# EAGLE schematic main (EAGLE 6.5.0)
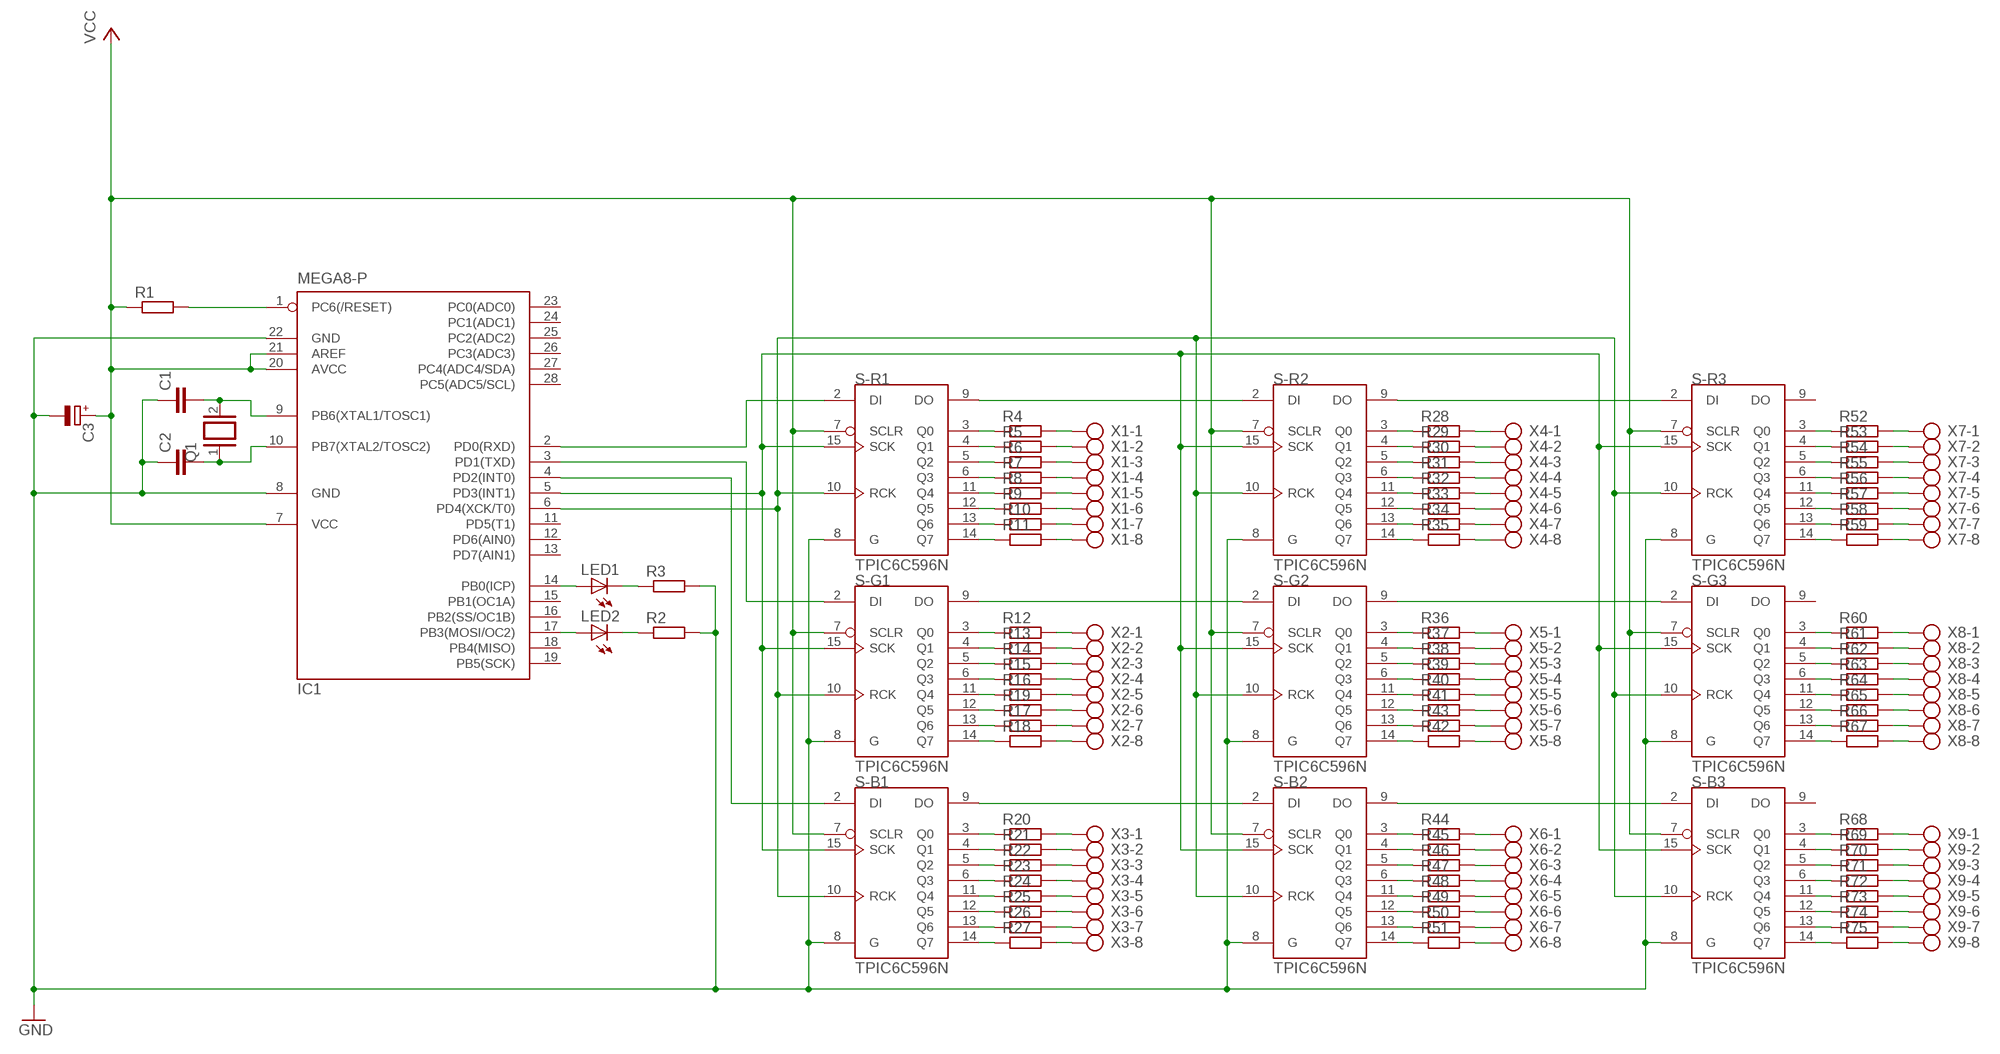
[diagram p0: schematic, sheet 1]

## Parts
C1  C-EU025-025X050  [C025-025X050]
C2  C-EU025-025X050  [C025-025X050]
C3  CPOL-EUE2.5-7  [E2,5-7]
IC1  MEGA8-P  [DIL28-3]
LED1  LED3MM  [LED3MM]
LED2  LED3MM  [LED3MM]
Q1  XTAL/S  [QS]
R1  R-EU_0207/2V  [0207/2V]
R2  R-EU_0207/2V  [0207/2V]
R3  R-EU_0207/2V  [0207/2V]
R4  R-EU_0207/2V  [0207/2V]
R5  R-EU_0207/2V  [0207/2V]
R6  R-EU_0207/2V  [0207/2V]
R7  R-EU_0207/2V  [0207/2V]
R8  R-EU_0207/2V  [0207/2V]
R9  R-EU_0207/2V  [0207/2V]
R10  R-EU_0207/2V  [0207/2V]
R11  R-EU_0207/2V  [0207/2V]
R12  R-EU_0207/2V  [0207/2V]
R13  R-EU_0207/2V  [0207/2V]
R14  R-EU_0207/2V  [0207/2V]
R15  R-EU_0207/2V  [0207/2V]
R16  R-EU_0207/2V  [0207/2V]
R17  R-EU_0207/2V  [0207/2V]
R18  R-EU_0207/2V  [0207/2V]
R19  R-EU_0207/2V  [0207/2V]
R20  R-EU_0207/2V  [0207/2V]
R21  R-EU_0207/2V  [0207/2V]
R22  R-EU_0207/2V  [0207/2V]
R23  R-EU_0207/2V  [0207/2V]
R24  R-EU_0207/2V  [0207/2V]
R25  R-EU_0207/2V  [0207/2V]
R26  R-EU_0207/2V  [0207/2V]
R27  R-EU_0207/2V  [0207/2V]
R28  R-EU_0207/2V  [0207/2V]
R29  R-EU_0207/2V  [0207/2V]
R30  R-EU_0207/2V  [0207/2V]
R31  R-EU_0207/2V  [0207/2V]
R32  R-EU_0207/2V  [0207/2V]
R33  R-EU_0207/2V  [0207/2V]
R34  R-EU_0207/2V  [0207/2V]
R35  R-EU_0207/2V  [0207/2V]
R36  R-EU_0207/2V  [0207/2V]
R37  R-EU_0207/2V  [0207/2V]
R38  R-EU_0207/2V  [0207/2V]
R39  R-EU_0207/2V  [0207/2V]
R40  R-EU_0207/2V  [0207/2V]
R41  R-EU_0207/2V  [0207/2V]
R42  R-EU_0207/2V  [0207/2V]
R43  R-EU_0207/2V  [0207/2V]
R44  R-EU_0207/2V  [0207/2V]
R45  R-EU_0207/2V  [0207/2V]
R46  R-EU_0207/2V  [0207/2V]
R47  R-EU_0207/2V  [0207/2V]
R48  R-EU_0207/2V  [0207/2V]
R49  R-EU_0207/2V  [0207/2V]
R50  R-EU_0207/2V  [0207/2V]
R51  R-EU_0207/2V  [0207/2V]
R52  R-EU_0207/2V  [0207/2V]
R53  R-EU_0207/2V  [0207/2V]
R54  R-EU_0207/2V  [0207/2V]
R55  R-EU_0207/2V  [0207/2V]
R56  R-EU_0207/2V  [0207/2V]
R57  R-EU_0207/2V  [0207/2V]
R58  R-EU_0207/2V  [0207/2V]
R59  R-EU_0207/2V  [0207/2V]
R60  R-EU_0207/2V  [0207/2V]
R61  R-EU_0207/2V  [0207/2V]
R62  R-EU_0207/2V  [0207/2V]
R63  R-EU_0207/2V  [0207/2V]
R64  R-EU_0207/2V  [0207/2V]
R65  R-EU_0207/2V  [0207/2V]
R66  R-EU_0207/2V  [0207/2V]
R67  R-EU_0207/2V  [0207/2V]
R68  R-EU_0207/2V  [0207/2V]
R69  R-EU_0207/2V  [0207/2V]
R70  R-EU_0207/2V  [0207/2V]
R71  R-EU_0207/2V  [0207/2V]
R72  R-EU_0207/2V  [0207/2V]
R73  R-EU_0207/2V  [0207/2V]
R74  R-EU_0207/2V  [0207/2V]
R75  R-EU_0207/2V  [0207/2V]
S-B1  TPIC6C596N  [DIL16]
S-B2  TPIC6C596N  [DIL16]
S-B3  TPIC6C596N  [DIL16]
S-G1  TPIC6C596N  [DIL16]
S-G2  TPIC6C596N  [DIL16]
S-G3  TPIC6C596N  [DIL16]
S-R1  TPIC6C596N  [DIL16]
S-R2  TPIC6C596N  [DIL16]
S-R3  TPIC6C596N  [DIL16]
X1  AK500/8-H  [AK500/8-H]
X2  AK500/8-H  [AK500/8-H]
X3  AK500/8-H  [AK500/8-H]
X4  AK500/8-H  [AK500/8-H]
X5  AK500/8-H  [AK500/8-H]
X6  AK500/8-H  [AK500/8-H]
X7  AK500/8-H  [AK500/8-H]
X8  AK500/8-H  [AK500/8-H]
X9  AK500/8-H  [AK500/8-H]

## Nets
GND: C1.1 C2.1 C3.- IC1.8(GND) IC1.22(GND) R2.2 R3.2 S-B1.8(G) S-B2.8(G) S-B3.8(G) S-G1.8(G) S-G2.8(G) S-G3.8(G) S-R1.8(G) S-R2.8(G) S-R3.8(G)
N$1: C1.2 IC1.9(PB6(XTAL1/TOSC1)) Q1.2
N$2: C2.2 IC1.10(PB7(XTAL2/TOSC2)) Q1.1
N$3: IC1.14(PB0(ICP)) LED1.A
N$4: IC1.1(PC6(/RESET)) R1.2
N$5: IC1.17(PB3(MOSI/OC2)) LED2.A
N$6: IC1.2(PD0(RXD)) S-R1.2(DI)
N$7: IC1.3(PD1(TXD)) S-G1.2(DI)
N$8: IC1.4(PD2(INT0)) S-B1.2(DI)
N$9: IC1.5(PD3(INT1)) S-B1.15(SCK) S-B2.15(SCK) S-B3.15(SCK) S-G1.15(SCK) S-G2.15(SCK) S-G3.15(SCK) S-R1.15(SCK) S-R2.15(SCK) S-R3.15(SCK)
N$10: IC1.6(PD4(XCK/T0)) S-B1.10(RCK) S-B2.10(RCK) S-B3.10(RCK) S-G1.10(RCK) S-G2.10(RCK) S-G3.10(RCK) S-R1.10(RCK) S-R2.10(RCK) S-R3.10(RCK)
N$11: S-R1.9(DO) S-R2.2(DI)
N$12: S-G1.9(DO) S-G2.2(DI)
N$13: S-B1.9(DO) S-B2.2(DI)
N$14: LED1.K(C) R3.1
N$15: LED2.K(C) R2.1
N$16: R4.1 S-R1.3(Q0)
N$17: R5.1 S-R1.4(Q1)
N$18: S-R2.9(DO) S-R3.2(DI)
N$19: S-B2.9(DO) S-B3.2(DI)
N$20: S-G2.9(DO) S-G3.2(DI)
N$21: R6.1 S-R1.5(Q2)
N$22: R7.1 S-R1.6(Q3)
N$23: R8.1 S-R1.11(Q4)
N$24: R9.1 S-R1.12(Q5)
N$25: R10.1 S-R1.13(Q6)
N$26: R11.1 S-R1.14(Q7)
N$27: R12.1 S-G1.3(Q0)
N$28: R13.1 S-G1.4(Q1)
N$29: R14.1 S-G1.5(Q2)
N$30: R15.1 S-G1.6(Q3)
N$31: R16.1 S-G1.11(Q4)
N$32: R17.1 S-G1.13(Q6)
N$33: R18.1 S-G1.14(Q7)
N$34: R19.1 S-G1.12(Q5)
N$35: R20.1 S-B1.3(Q0)
N$36: R21.1 S-B1.4(Q1)
N$37: R22.1 S-B1.5(Q2)
N$38: R23.1 S-B1.6(Q3)
N$39: R25.1 S-B1.12(Q5)
N$40: R26.1 S-B1.13(Q6)
N$41: R27.1 S-B1.14(Q7)
N$42: R24.1 S-B1.11(Q4)
N$43: R28.1 S-R2.3(Q0)
N$44: R29.1 S-R2.4(Q1)
N$45: R30.1 S-R2.5(Q2)
N$46: R31.1 S-R2.6(Q3)
N$47: R32.1 S-R2.11(Q4)
N$48: R33.1 S-R2.12(Q5)
N$49: R34.1 S-R2.13(Q6)
N$50: R35.1 S-R2.14(Q7)
N$51: R36.1 S-G2.3(Q0)
N$52: R37.1 S-G2.4(Q1)
N$53: R38.1 S-G2.5(Q2)
N$54: R39.1 S-G2.6(Q3)
N$55: R40.1 S-G2.11(Q4)
N$56: R41.1 S-G2.12(Q5)
N$57: R42.1 S-G2.14(Q7)
N$58: R43.1 S-G2.13(Q6)
N$59: R44.1 S-B2.3(Q0)
N$60: R45.1 S-B2.4(Q1)
N$61: R46.1 S-B2.5(Q2)
N$62: R47.1 S-B2.6(Q3)
N$63: R48.1 S-B2.11(Q4)
N$64: R49.1 S-B2.12(Q5)
N$65: R50.1 S-B2.13(Q6)
N$66: R51.1 S-B2.14(Q7)
N$67: R52.1 S-R3.3(Q0)
N$68: R53.1 S-R3.4(Q1)
N$69: R54.1 S-R3.5(Q2)
N$70: R55.1 S-R3.6(Q3)
N$71: R56.1 S-R3.11(Q4)
N$72: R57.1 S-R3.12(Q5)
N$73: R58.1 S-R3.13(Q6)
N$74: R59.1 S-R3.14(Q7)
N$75: R60.1 S-G3.3(Q0)
N$76: R61.1 S-G3.4(Q1)
N$77: R62.1 S-G3.5(Q2)
N$78: R63.1 S-G3.6(Q3)
N$79: R64.1 S-G3.11(Q4)
N$80: R66.1 S-G3.13(Q6)
N$81: R67.1 S-G3.14(Q7)
N$82: R68.1 S-B3.3(Q0)
N$83: R69.1 S-B3.4(Q1)
N$84: R70.1 S-B3.5(Q2)
N$85: R71.1 S-B3.6(Q3)
N$86: R72.1 S-B3.11(Q4)
N$87: R73.1 S-B3.12(Q5)
N$88: R74.1 S-B3.13(Q6)
N$89: R75.1 S-B3.14(Q7)
N$90: R65.1 S-G3.12(Q5)
N$91: R27.2 X3.8
N$92: R26.2 X3.7
N$93: R25.2 X3.6
N$94: R24.2 X3.5
N$95: R23.2 X3.4
N$96: R22.2 X3.3
N$97: R21.2 X3.2
N$98: R20.2 X3.1
N$99: R12.2 X2.1
N$100: R13.2 X2.2
N$101: R14.2 X2.3
N$102: R16.2 X2.5
N$103: R15.2 X2.4
N$104: R19.2 X2.6
N$105: R17.2 X2.7
N$106: R18.2 X2.8
N$107: R4.2 X1.1
N$108: R5.2 X1.2
N$109: R6.2 X1.3
N$110: R7.2 X1.4
N$111: R8.2 X1.5
N$112: R9.2 X1.6
N$113: R10.2 X1.7
N$114: R11.2 X1.8
N$115: R28.2 X4.1
N$116: R29.2 X4.2
N$117: R30.2 X4.3
N$118: R31.2 X4.4
N$119: R32.2 X4.5
N$120: R33.2 X4.6
N$121: R34.2 X4.7
N$122: R35.2 X4.8
N$123: R36.2 X5.1
N$124: R37.2 X5.2
N$125: R38.2 X5.3
N$126: R39.2 X5.4
N$127: R40.2 X5.5
N$128: R41.2 X5.6
N$129: R43.2 X5.7
N$130: R42.2 X5.8
N$131: R44.2 X6.1
N$132: R45.2 X6.2
N$133: R46.2 X6.3
N$134: R47.2 X6.4
N$135: R48.2 X6.5
N$136: R49.2 X6.6
N$137: R50.2 X6.7
N$138: R51.2 X6.8
N$139: R52.2 X7.1
N$140: R53.2 X7.2
N$141: R54.2 X7.3
N$142: R55.2 X7.4
N$143: R56.2 X7.5
N$144: R57.2 X7.6
N$145: R58.2 X7.7
N$146: R59.2 X7.8
N$147: R60.2 X8.1
N$148: R61.2 X8.2
N$149: R62.2 X8.3
N$150: R63.2 X8.4
N$151: R64.2 X8.5
N$152: R65.2 X8.6
N$153: R66.2 X8.7
N$154: R67.2 X8.8
N$155: R68.2 X9.1
N$156: R69.2 X9.2
N$157: R70.2 X9.3
N$158: R71.2 X9.4
N$159: R72.2 X9.5
N$160: R73.2 X9.6
N$161: R74.2 X9.7
N$162: R75.2 X9.8
VCC: C3.+ IC1.7(VCC) IC1.20(AVCC) IC1.21(AREF) R1.1 S-B1.7(SCLR) S-B2.7(SCLR) S-B3.7(SCLR) S-G1.7(SCLR) S-G2.7(SCLR) S-G3.7(SCLR) S-R1.7(SCLR) S-R2.7(SCLR) S-R3.7(SCLR)
Unconnected: IC1.11(PD5(T1)) IC1.12(PD6(AIN0)) IC1.13(PD7(AIN1)) IC1.15(PB1(OC1A)) IC1.16(PB2(SS/OC1B)) IC1.18(PB4(MISO)) IC1.19(PB5(SCK)) IC1.23(PC0(ADC0)) IC1.24(PC1(ADC1)) IC1.25(PC2(ADC2)) IC1.26(PC3(ADC3)) IC1.27(PC4(ADC4/SDA)) IC1.28(PC5(ADC5/SCL)) S-B3.9(DO) S-G3.9(DO) S-R3.9(DO)

## Power pins joined to a net without a drawn wire
GND: S-B1.16(GND) S-B2.16(GND) S-B3.16(GND) S-G1.16(GND) S-G2.16(GND) S-G3.16(GND) S-R1.16(GND) S-R2.16(GND) S-R3.16(GND)
VCC: S-B1.1(VCC) S-B2.1(VCC) S-B3.1(VCC) S-G1.1(VCC) S-G2.1(VCC) S-G3.1(VCC) S-R1.1(VCC) S-R2.1(VCC) S-R3.1(VCC)

## Library data of the parts
C1 C2 = rcl:C-EU: CAPACITOR, European symbol
C3 = rcl:CPOL-EU: POLARIZED CAPACITOR, European symbol
IC1 = atmel:MEGA8-P: MICROCONTROLLER 8 Kbytes FLASH, 1 kbytes SRAM, 512 bytes EEPROM, USART, 4-channel 10 bit ADC, 2-channel 8 bit ADC Pin compatible with Atmega48, ATMega88, ATMega168 Source: avr.lbr; OC_FARNELL: unknown; OC_NEWARK: unknown
LED1 LED2 = led:LED: LED OSRAM: - CHIPLED LG R971, LG N971, LY N971, LG Q971, LY Q971, LO R971, LY R971 LH N974, LH R974 LS Q976, LO Q976, LY Q976 LO Q996 - Hyper CHIPLED LW Q18S LB Q993, LB Q99A, LB R99A - SideLED LS A670, LO A670, LY A670, LG A670, LP A670 LB A673, LV A673, LT A673, LW A673 LH A674 LY A675 LS A676, LA A676, LO A676, LY A676, LW A676 LS A679, LY A679, LG A679 - Hyper Micro SIDELED® LS Y876, LA Y876, LO Y876, LY Y876 LT Y87S - SmartLED LW L88C, LW L88S LB L89C, LB L89S, LG L890 LS L89K, LO L89K, LY L89K LS L896, LA L896, LO L896, LY L896 - TOPLED LS T670, LO T670, LY T670, LG T670, LP T670 LSG T670, LSP T670, LSY T670, LOP T670, LYG T670 LG T671, LOG T671, LSG T671 LB T673, LV T673, LT T673, LW T673 LH T674 LS T676, LA T676, LO T676, LY T676, LB T676, LH T676, LSB T676, LW T676 LB T67C, LV T67C, LT T67C, LS T67K, LO T67K, LY T67K, LW E67C LS E67B, LA E67B, LO E67B, LY E67B, LB E67C, LV E67C, LT E67C LW T67C LS T679, LY T679, LG T679 LS T770, LO T770, LY T770, LG T770, LP T770 LB T773, LV T773, LT T773, LW T773 LH T774 LS E675, LA E675, LY E675, LS T675 LS T776, LA T776, LO T776, LY T776, LB T776 LHGB T686 LT T68C, LB T68C - Hyper Mini TOPLED® LB M676 - Mini TOPLED Santana® LG M470 LS M47K, LO M47K, LY M47K Source: http://www.osram.convergy.de LUXEON: - LUMILED® LXK2-PW12-R00, LXK2-PW12-S00, LXK2-PW14-U00, LXK2-PW14-V00 LXK2-PM12-R00, LXK2-PM12-S00, LXK2-PM14-U00 LXK2-PE12-Q00, LXK2-PE12-R00, LXK2-PE12-S00, LXK2-PE14-T00, LXK2-PE14-U00 LXK2-PB12-K00, LXK2-PB12-L00, LXK2-PB12-M00, LXK2-PB14-N00, LXK2-PB14-P00, LXK2-PB14-Q00 LXK2-PR12-L00, LXK2-PR12-M00, LXK2-PR14-Q00, LXK2-PR14-R00 LXK2-PD12-Q00, LXK2-PD12-R00, LXK2-PD12-S00 LXK2-PH12-R00, LXK2-PH12-S00 LXK2-PL12-P00, LXK2-PL12-Q00, LXK2-PL12-R00 Source: www.luxeon.com KINGBRIGHT: KA-3528ASYC Source: www.kingbright.com
Q1 = special:XTAL/S: CRYSTAL
R1-R75 = rcl:R-EU_: RESISTOR, European symbol
S-B1-S-B3 S-G1-S-G3 S-R1-S-R3 = tpic:TPIC6C596
X1-X9 = con-ptr500:AK500/8-H: CONNECTOR Aug. 2004 / PTR Meßtechnik: Die Bezeichnung der Serie AK505 wurde geändert. Es handelt sich hierbei um AK500 in horizontaler Ausführung.; OC_FARNELL: unknown; OC_NEWARK: unknown